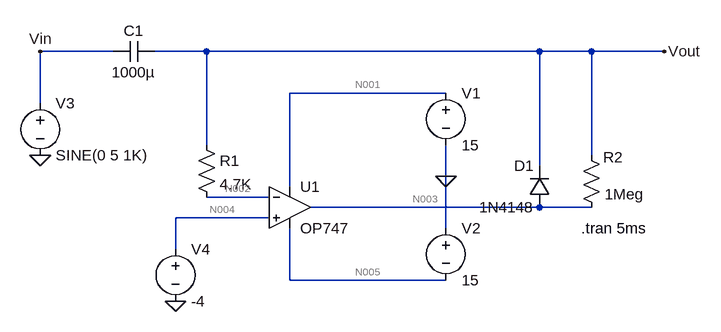
[diagram p0: schematic CLAMPER_neg.asc]
CLAMPER_neg.asc, the LTspice schematic file:
Version 4
SHEET 1 1584 680
WIRE -96 0 -208 0
WIRE 48 0 -32 0
WIRE 560 0 48 0
WIRE 640 0 560 0
WIRE 752 0 640 0
WIRE 416 64 176 64
WIRE -208 80 -208 0
WIRE 48 144 48 0
WIRE 640 160 640 0
WIRE 560 176 560 0
WIRE 416 192 416 144
WIRE 176 208 176 64
WIRE 144 224 48 224
WIRE 560 240 208 240
WIRE 640 240 560 240
WIRE 144 256 0 256
WIRE 416 272 416 192
WIRE 0 304 0 256
WIRE 176 352 176 272
WIRE 416 352 176 352
FLAG 416 192 0
FLAG -208 160 0
FLAG 752 0 Vout
FLAG -208 0 Vin
FLAG 0 384 0
SYMBOL OpAmps\\OP747 176 176 R0
SYMATTR InstName U1
SYMBOL voltage 416 48 R0
WINDOW 123 0 0 Left 0
WINDOW 39 0 0 Left 0
SYMATTR InstName V1
SYMATTR Value 15
SYMBOL voltage 416 256 R0
WINDOW 123 0 0 Left 0
WINDOW 39 0 0 Left 0
SYMATTR InstName V2
SYMATTR Value 15
SYMBOL res 32 128 R0
SYMATTR InstName R1
SYMATTR Value 4.7K
SYMBOL res 624 144 R0
WINDOW 0 34 19 Left 2
SYMATTR InstName R2
SYMATTR Value 1Meg
SYMBOL diode 576 240 R180
WINDOW 0 24 64 Left 2
WINDOW 3 24 0 Left 2
SYMATTR InstName D1
SYMATTR Value 1N4148
SYMBOL cap -32 -16 R90
WINDOW 0 0 32 VBottom 2
WINDOW 3 32 32 VTop 2
SYMATTR InstName C1
SYMATTR Value 1000µ
SYMBOL voltage -208 64 R0
WINDOW 123 0 0 Left 0
WINDOW 39 0 0 Left 0
SYMATTR InstName V3
SYMATTR Value SINE(0 5 1K)
SYMBOL voltage 0 288 R0
WINDOW 123 0 0 Left 0
WINDOW 39 0 0 Left 0
SYMATTR InstName V4
SYMATTR Value -4
TEXT 624 272 Left 2 !.tran 5ms

The netlist it stands for:
* CLAMPER_neg.asc
XU1 N004 N002 N001 N005 N003 OP747  ; pins In+ In- V+ V- OUT
V1 N001 0 15
V2 0 N005 15
R1 Vout N002 4.7K
R2 Vout N003 1Meg
D1 N003 Vout 1N4148
C1 Vout Vin 1000µ
V3 Vin 0 SINE(0 5 1K)
V4 N004 0 -4
.model D D
.lib standard.dio
.tran 5ms
.backanno
.end

* Results of the author's LTspice run, read from the files saved beside the schematic
* Operating Point, zero values left out:
*   V(n002) = -4 V
*   V(n005) = -15 V
*   V(n001) = 15 V
*   V(n004) = -4 V
*   V(n003) = -4.009 V
*   V(vout) = -4 V
*   I(D1) = -440.2 pA
*   I(R2) = 8.7 nA
*   I(R1) = -9.141 nA
*   I(V4) = 11.14 nA
*   I(V2) = -305.3 µA
*   I(V1) = -305.4 µA
*   Ix(u1:1) = -11.14 nA
*   Ix(u1:2) = -9.141 nA
*   Ix(u1:99) = 305.4 µA
*   Ix(u1:50) = -305.3 µA
*   Ix(u1:45) = 9.141 nA
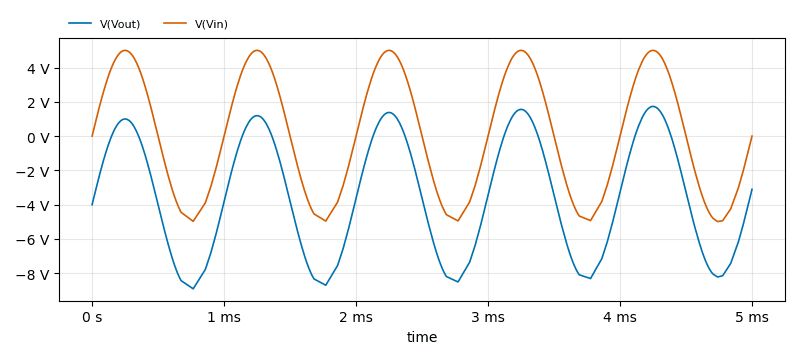
[diagram p1: Transient Analysis of CLAMPER_neg.asc, plotted from the saved traces]
* Transient Analysis, 1 run:
*   V(Vout): min -8.907 V, max 1.729 V, average -3.577 V, rms 5.005 V, last -3.103 V
*   V(Vin): min -4.988 V, max 5 V, average 19.77 mV, rms 3.516 V, last 0 V